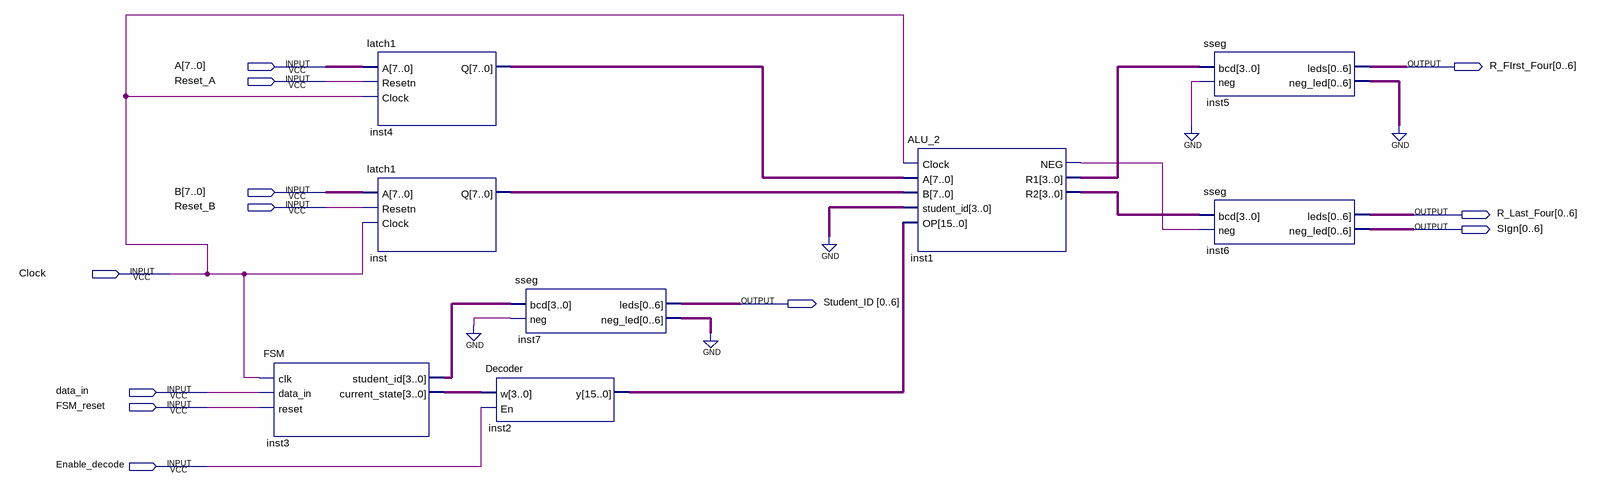
[diagram p0: schematic sheet]
// Quartus schematic Problem_2.bdf as structural Verilog: 8 symbols, 12 pins
module Problem_2 (
  input  [7:0] A,
  input  Reset_A,
  input  [7:0] B,
  input  Reset_B,
  input  Clock,
  input  data_in,
  input  FSM_reset,
  input  Enable_decode,
  output [0:6] R_FIrst_Four,
  output [0:6] R_Last_Four,
  output [0:6] SIgn,
  output [0:6] Student_ID
);

  wire inst1_neg;
  wire [3:0] inst1_r1, inst1_r2, inst3_current_state, inst3_student_id;
  wire [6:0] inst5_neg_led, inst7_neg_led;
  wire [7:0] inst4_q, inst_q;
  wire [15:0] inst2_y;

  FSM inst3 (
    .clk(Clock), .data_in(data_in), .reset(FSM_reset), .student_id(inst3_student_id),
    .current_state(inst3_current_state));
  latch1 inst4 (.A(A), .Resetn(Reset_A), .Clock(Clock), .Q(inst4_q));
  latch1 inst (.A(B), .Resetn(Reset_B), .Clock(Clock), .Q(inst_q));
  Decoder inst2 (.w(inst3_current_state), .En(Enable_decode), .y(inst2_y));
  sseg inst7 (.bcd(inst3_student_id), .neg(1'b0), .leds(Student_ID), .neg_led(inst7_neg_led));
  ALU_2 inst1 (
    .Clock(Clock), .A(inst4_q), .B(inst_q), .student_id(4'b0000), .OP(inst2_y), .NEG(inst1_neg),
    .R1(inst1_r1), .R2(inst1_r2));
  sseg inst5 (.bcd(inst1_r1), .neg(1'b0), .leds(R_FIrst_Four), .neg_led(inst5_neg_led));
  sseg inst6 (.bcd(inst1_r2), .neg(inst1_neg), .leds(R_Last_Four), .neg_led(SIgn));
  // also tied to GND on the sheet: {inst7_neg_led[0], inst7_neg_led[1], inst7_neg_led[2], inst7_neg_led[3], inst7_neg_led[4], inst7_neg_led[5], inst7_neg_led[6], inst5_neg_led[0], inst5_neg_led[1], inst5_neg_led[2], inst5_neg_led[3], inst5_neg_led[4], inst5_neg_led[5], inst5_neg_led[6]}
endmodule
